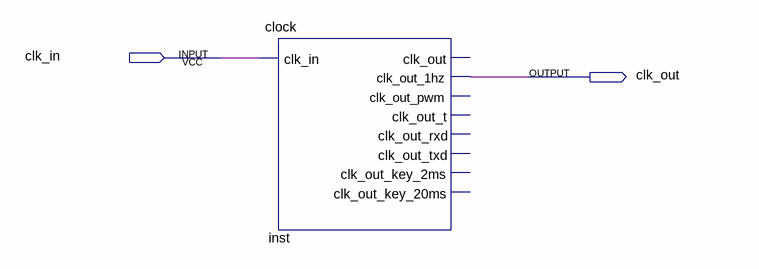
[diagram p0: schematic sheet]
// Quartus schematic clock_bdf.bdf as structural Verilog: 1 symbols, 2 pins
module clock_bdf (
  input  clk_in,
  output clk_out
);

  clock inst (
    .clk_in(clk_in), .clk_out_1hz(clk_out));  // open: clk_out, clk_out_pwm, clk_out_t, clk_out_rxd, clk_out_txd, clk_out_key_2ms, clk_out_key_20ms
endmodule
